# Altium project Cube Brain.PrjPcb
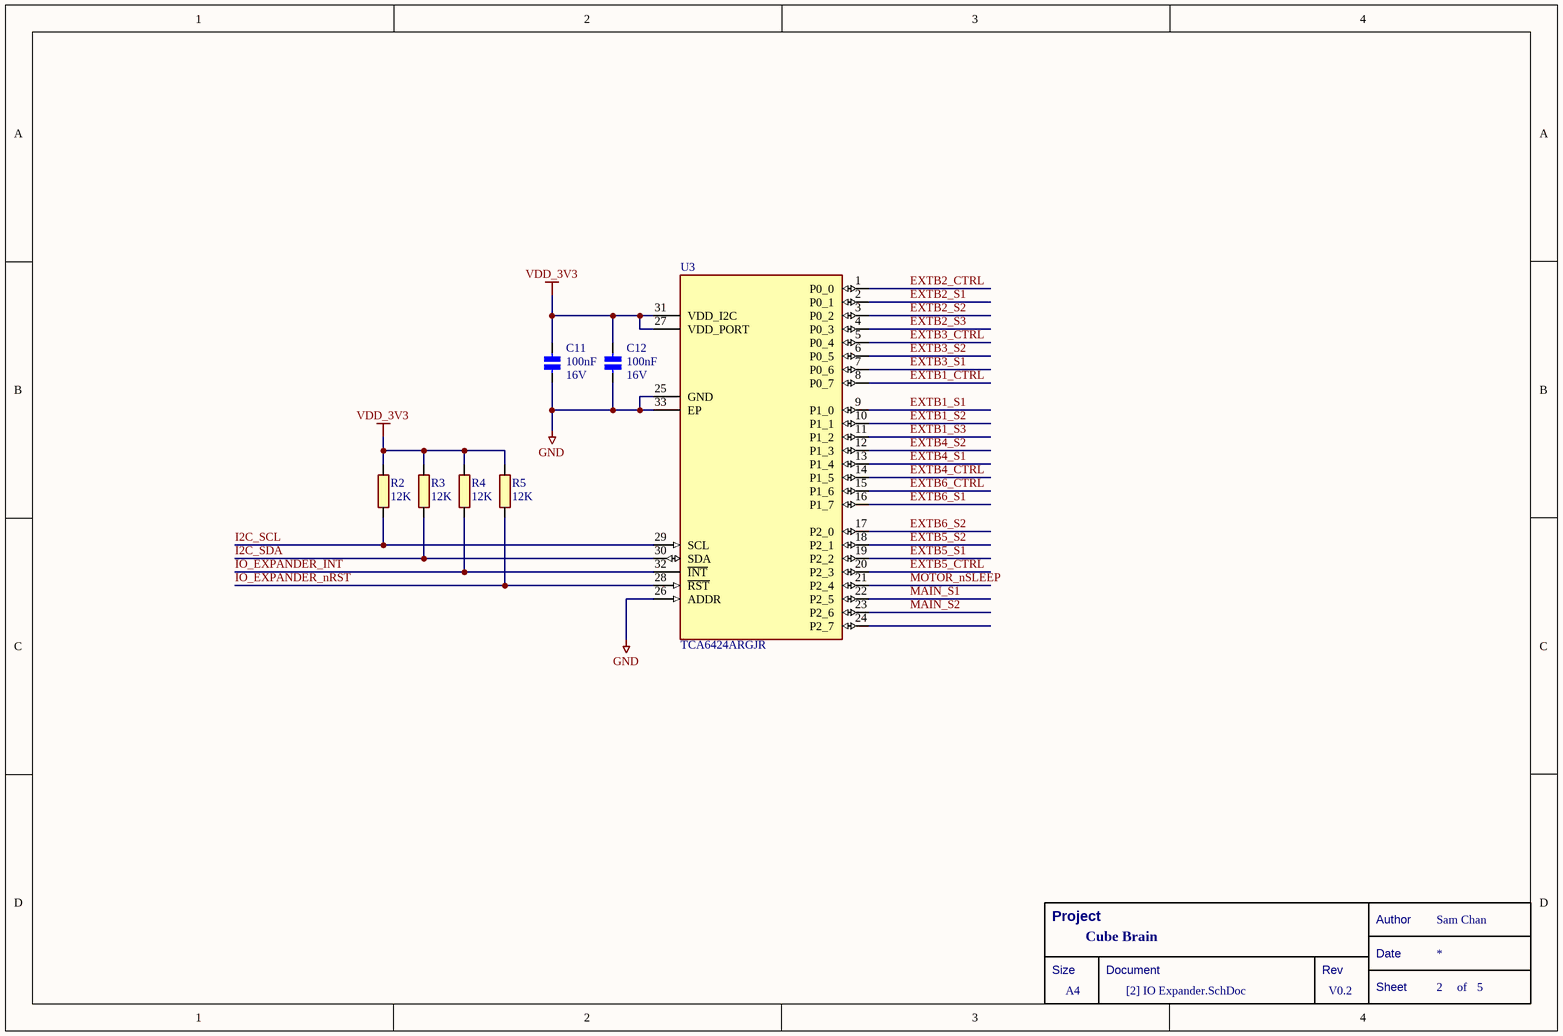
[diagram p0: [2] IO Expander.SchDoc]
Project: Cube Brain; VersionRevision: V0.2
3 sheets, 65 parts. Net scope: global (net labels, ports and power ports of the same name join across sheets).
Board file: Cube Brain.PcbDoc
Sheets:
  [2] IO Expander.SchDoc
  [5] Motors.SchDoc
  [4] Reflective Sensors.SchDoc

## Sheet [2] IO Expander.SchDoc
size A4; DocumentNumber: 2; SheetNumber: 2; SheetTotal: 5

### Parts
(Parts that share a designator on the sheet are numbered #1, #2 ... from top to bottom, then left to right.)
*#1  Title Block  (value not drawn)  (graphical)
C11  Voltage - Rated: 16V  [CAPC0402X05N]  (hidden comment: 100nF)
C12  Voltage - Rated: 16V  [CAPC0402X05N]  (hidden comment: 100nF)
R2  12K  [RESC0402X04N]
R3  12K  [RESC0402X04N]
R4  12K  [RESC0402X04N]
R5  12K  [RESC0402X04N]
U3  TCA6424ARGJR  [TCA6424ARGJR]

### Nets
GND: C11.2 C12.2 U3.25(GND) U3.26(ADDR) U3.33(EP)
VDD_3V3: C11.1 C12.1 R2.2 R3.2 R4.2 R5.2 U3.27(VDD_PORT) U3.31(VDD_I2C)
EXTB1_CTRL: U3.8(P0_7)
EXTB1_S1: U3.9(P1_0)
EXTB1_S2: U3.10(P1_1)
EXTB1_S3: U3.11(P1_2)
EXTB2_CTRL: U3.1(P0_0)
EXTB2_S1: U3.2(P0_1)
EXTB2_S2: U3.3(P0_2)
EXTB2_S3: U3.4(P0_3)
EXTB3_CTRL: U3.5(P0_4)
EXTB3_S1: U3.7(P0_6)
EXTB3_S2: U3.6(P0_5)
EXTB4_CTRL: U3.14(P1_5)
EXTB4_S1: U3.13(P1_4)
EXTB4_S2: U3.12(P1_3)
EXTB5_CTRL: U3.20(P2_3)
EXTB5_S1: U3.19(P2_2)
EXTB5_S2: U3.18(P2_1)
EXTB6_CTRL: U3.15(P1_6)
EXTB6_S1: U3.16(P1_7)
EXTB6_S2: U3.17(P2_0)
I2C_SCL: R2.1 U3.29(SCL)
I2C_SDA: R3.1 U3.30(SDA)
IO_EXPANDER_INT: R4.1 U3.32(~{INT})
IO_EXPANDER_nRST: R5.1 U3.28(~{RST})
MAIN_S1: U3.22(P2_5)
MAIN_S2: U3.23(P2_6)
MOTOR_nSLEEP: U3.21(P2_4)

Not connected (* = marked no-connect by the designer): U3 24(P2_7)

### Notes on the sheet
- (in symbol Title Block) Project; Author; Sam Chan; Date; Size; Document; Rev; A4; Sheet; of

### Library data of the parts
*#1 = Title Block: Standard Title Block
C11 C12 = CER 100NF 16V: CAP CER 0.1UF 16V X7R 0402; Manufacturer: Samsung Electro-Mechanics; Manufacturer Part Number: CL05B104KO5NNNC; Category: Capacitors; Supplier 1: LCSC; Supplier Part Number 1: C1525; Package / Case: 0402; Capacitance: 100nF
R2-R5 = RES 12K: RES SMD 12K OHM 1% 1/16W 0402; Manufacturer: YAGEO; Manufacturer Part Number: RC0402FR-0712KL; Category: Resistors; Package / Case: 0402; Supplier 1: LCSC; Supplier Part Number 1: C114760; Resistance: 12K
U3 = TCA6424ARGJR: IC I/O EXPANDER I2C 24B 32UQFN; Manufacturer: Texas Instruments; Categories: I/O Expanders; Case: 32-UFQFN Exposed Pad; Manufacturer Part Number: TCA6424ARGJR; Supplier 1: LCSC; Supplier Part Number 1: C80692

## Sheet [5] Motors.SchDoc
size A4; DocumentNumber: 5; SheetNumber: 5; SheetTotal: 5
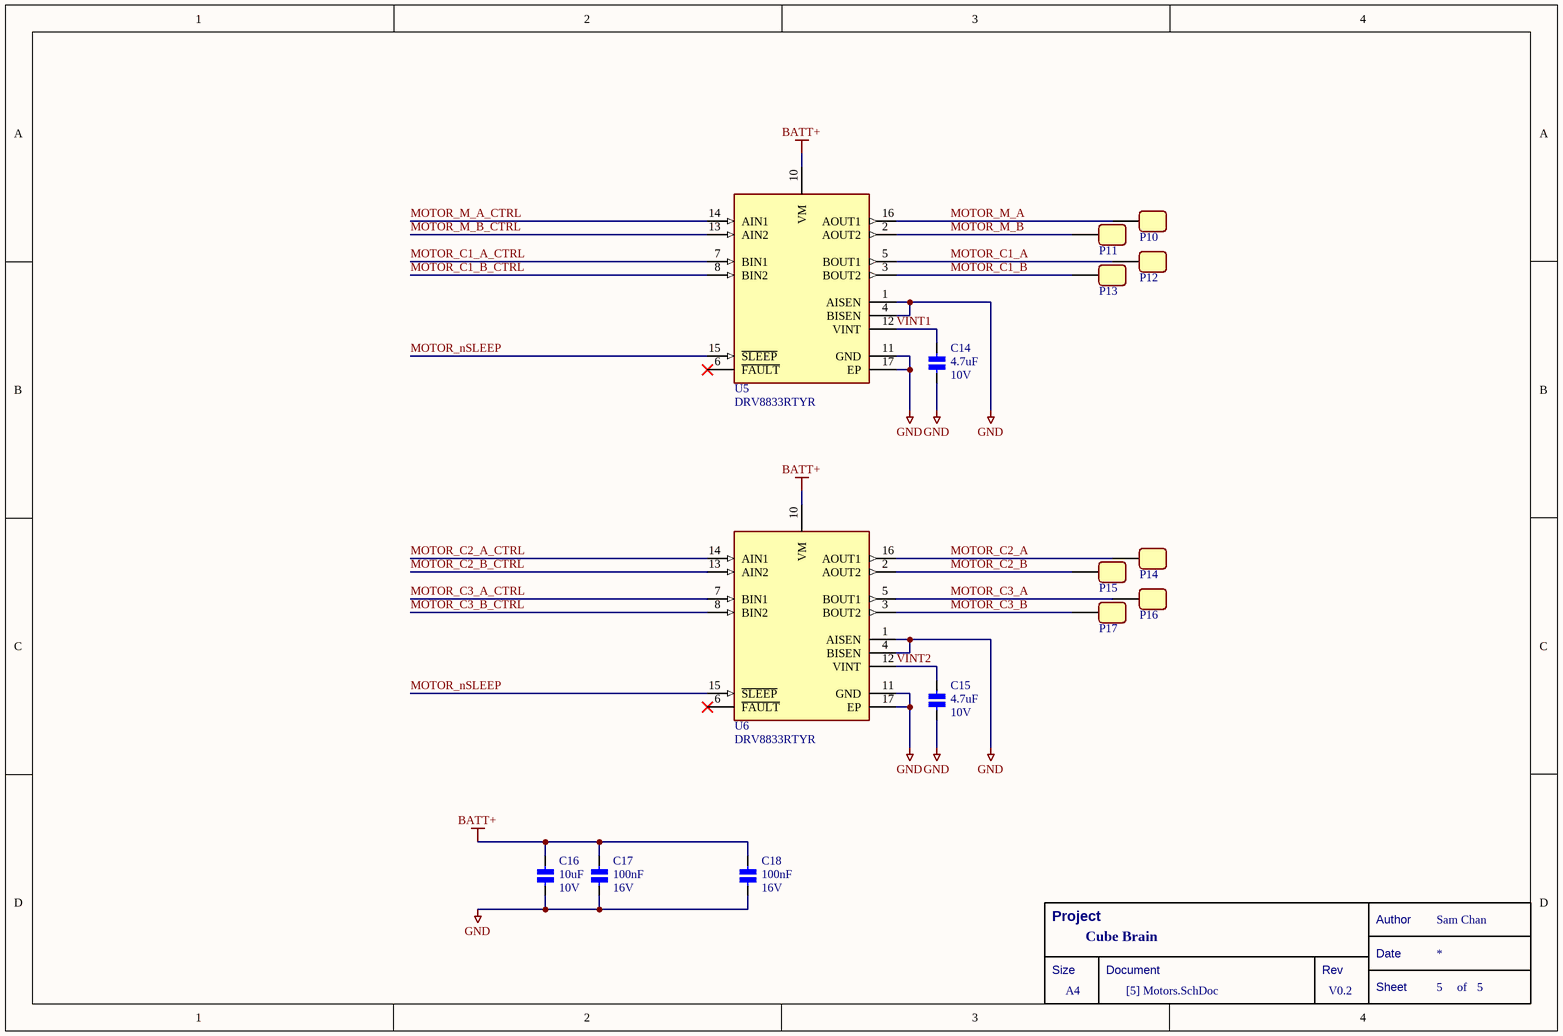
[diagram p1: [5] Motors.SchDoc]

### Parts
(Parts that share a designator on the sheet are numbered #1, #2 ... from top to bottom, then left to right.)
*#2  Title Block  (value not drawn)  (graphical)
C14  Voltage - Rated: 10V  [CAPC0402X05N]  (hidden comment: 4.7uF)
C15  Voltage - Rated: 10V  [CAPC0402X05N]  (hidden comment: 4.7uF)
C16  Voltage - Rated: 10V  [CAPC0402X05N]  (hidden comment: 10uF)
C17  Voltage - Rated: 16V  [CAPC0402X05N]  (hidden comment: 100nF)
C18  Voltage - Rated: 16V  [CAPC0402X05N]  (hidden comment: 100nF)
P10  PAD_4  [PAD_B2B]  (value not drawn)  (no BOM)
P11  PAD_4  [PAD_B2B]  (value not drawn)  (no BOM)
P12  PAD_4  [PAD_B2B]  (value not drawn)  (no BOM)
P13  PAD_4  [PAD_B2B]  (value not drawn)  (no BOM)
P14  PAD_4  [PAD_B2B]  (value not drawn)  (no BOM)
P15  PAD_4  [PAD_B2B]  (value not drawn)  (no BOM)
P16  PAD_4  [PAD_B2B]  (value not drawn)  (no BOM)
P17  PAD_4  [PAD_B2B]  (value not drawn)  (no BOM)
U5  DRV8833RTYR  [DRV8833CRTER]
U6  DRV8833RTYR  [DRV8833CRTER]

### Nets
BATT+: C16.1 C17.1 C18.1 U5.10(VM) U6.10(VM)
GND: C14.2 C15.2 C16.2 C17.2 C18.2 U5.1(AISEN) U5.4(BISEN) U5.11(GND) U5.17(EP) U6.1(AISEN) U6.4(BISEN) U6.11(GND) U6.17(EP)
MOTOR_C1_A: P12.1 U5.5(BOUT1)
MOTOR_C1_A_CTRL: U5.7(BIN1)
MOTOR_C1_B: P13.1 U5.3(BOUT2)
MOTOR_C1_B_CTRL: U5.8(BIN2)
MOTOR_C2_A: P14.1 U6.16(AOUT1)
MOTOR_C2_A_CTRL: U6.14(AIN1)
MOTOR_C2_B: P15.1 U6.2(AOUT2)
MOTOR_C2_B_CTRL: U6.13(AIN2)
MOTOR_C3_A: P16.1 U6.5(BOUT1)
MOTOR_C3_A_CTRL: U6.7(BIN1)
MOTOR_C3_B: P17.1 U6.3(BOUT2)
MOTOR_C3_B_CTRL: U6.8(BIN2)
MOTOR_M_A: P10.1 U5.16(AOUT1)
MOTOR_M_A_CTRL: U5.14(AIN1)
MOTOR_M_B: P11.1 U5.2(AOUT2)
MOTOR_M_B_CTRL: U5.13(AIN2)
MOTOR_nSLEEP: U5.15(~{SLEEP}) U6.15(~{SLEEP})
VINT1: C14.1 U5.12(VINT)
VINT2: C15.1 U6.12(VINT)

Not connected (* = marked no-connect by the designer): U5 6(~{FAULT})*; U6 6(~{FAULT})*

### Notes on the sheet
- (in symbol Title Block) Project; Author; Sam Chan; Date; Size; Document; Rev; A4; Sheet; of

### Library data of the parts
*#2 = Title Block: Standard Title Block
C14 C15 = CER 4.7UF 10V: CAP CER 4.7UF 10V X5R 0402; Manufacturer: Samsung Electro-Mechanics; Manufacturer Part Number: CL05A475MP5NRNC; Category: Capacitors; Supplier 1: LCSC; Supplier Part Number 1: C23733; Package / Case: 0402; Capacitance: 4.7uF
C16 = CER 10UF 10V: CAP CER 10UF 10V X5R 0402; Manufacturer: Murata Electronics; Manufacturer Part Number: GRM155R61A106ME44D; Category: Capacitors; Supplier 1: LCSC; Supplier Part Number 1: C77000; Package / Case: 0402; Capacitance: 10uF
C17 C18 = CER 100NF 16V: as C11 on sheet [2] IO Expander; Category: Capacitors; Supplier 1: LCSC; Supplier Part Number 1: C1525; Package / Case: 0402; Capacitance: 100nF
P10-P17 = PAD_4: a Pad for board to board connection
U5 U6 = DRV8833RTYR: IC MOTOR DRIVER; Manufacturer: Texas Instruments; Categories: Motor Drivers, Controllers; Case: 16-WQFN Exposed Pad; Manufacturer Part Number: DRV8833RTYR; Supplier 1: LCSC; Supplier Part Number 1: C154936

## Sheet [4] Reflective Sensors.SchDoc
size A4; DocumentNumber: 4; SheetNumber: 4; SheetTotal: 5
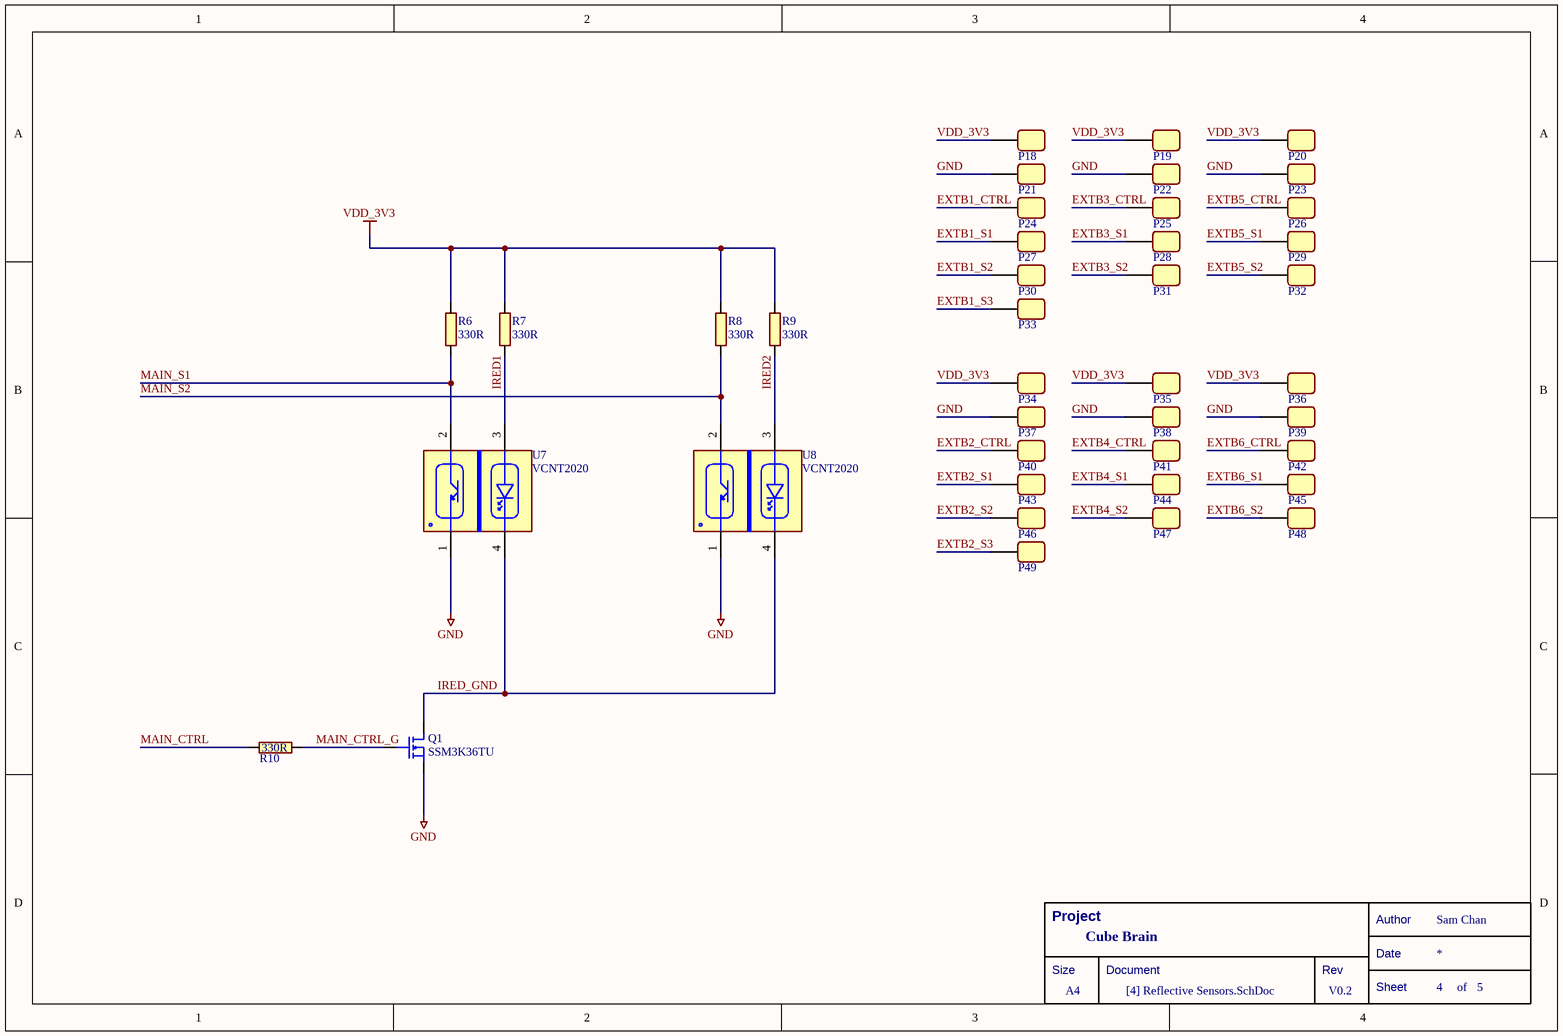
[diagram p2: [4] Reflective Sensors.SchDoc]

### Parts
(Parts that share a designator on the sheet are numbered #1, #2 ... from top to bottom, then left to right.)
*#3  Title Block  (value not drawn)  (graphical)
P18  PAD_4  [PAD_B2B]  (value not drawn)  (no BOM)
P19  PAD_4  [PAD_B2B]  (value not drawn)  (no BOM)
P20  PAD_4  [PAD_B2B]  (value not drawn)  (no BOM)
P21  PAD_4  [PAD_B2B]  (value not drawn)  (no BOM)
P22  PAD_4  [PAD_B2B]  (value not drawn)  (no BOM)
P23  PAD_4  [PAD_B2B]  (value not drawn)  (no BOM)
P24  PAD_4  [PAD_B2B]  (value not drawn)  (no BOM)
P25  PAD_4  [PAD_B2B]  (value not drawn)  (no BOM)
P26  PAD_4  [PAD_B2B]  (value not drawn)  (no BOM)
P27  PAD_4  [PAD_B2B]  (value not drawn)  (no BOM)
P28  PAD_4  [PAD_B2B]  (value not drawn)  (no BOM)
P29  PAD_4  [PAD_B2B]  (value not drawn)  (no BOM)
P30  PAD_4  [PAD_B2B]  (value not drawn)  (no BOM)
P31  PAD_4  [PAD_B2B]  (value not drawn)  (no BOM)
P32  PAD_4  [PAD_B2B]  (value not drawn)  (no BOM)
P33  PAD_4  [PAD_B2B]  (value not drawn)  (no BOM)
P34  PAD_4  [PAD_B2B]  (value not drawn)  (no BOM)
P35  PAD_4  [PAD_B2B]  (value not drawn)  (no BOM)
P36  PAD_4  [PAD_B2B]  (value not drawn)  (no BOM)
P37  PAD_4  [PAD_B2B]  (value not drawn)  (no BOM)
P38  PAD_4  [PAD_B2B]  (value not drawn)  (no BOM)
P39  PAD_4  [PAD_B2B]  (value not drawn)  (no BOM)
P40  PAD_4  [PAD_B2B]  (value not drawn)  (no BOM)
P41  PAD_4  [PAD_B2B]  (value not drawn)  (no BOM)
P42  PAD_4  [PAD_B2B]  (value not drawn)  (no BOM)
P43  PAD_4  [PAD_B2B]  (value not drawn)  (no BOM)
P44  PAD_4  [PAD_B2B]  (value not drawn)  (no BOM)
P45  PAD_4  [PAD_B2B]  (value not drawn)  (no BOM)
P46  PAD_4  [PAD_B2B]  (value not drawn)  (no BOM)
P47  PAD_4  [PAD_B2B]  (value not drawn)  (no BOM)
P48  PAD_4  [PAD_B2B]  (value not drawn)  (no BOM)
P49  PAD_4  [PAD_B2B]  (value not drawn)  (no BOM)
Q1  SSM3K36TU  [SSM3K36TU]
R6  330R  [RESC0402X04N]
R7  330R  [RESC0402X04N]
R8  330R  [RESC0402X04N]
R9  330R  [RESC0402X04N]
R10  330R  [RESC0402X04N]
U7  VCNT2020  [VCNT2020]
U8  VCNT2020  [VCNT2020]

### Nets
GND: P21.1 P22.1 P23.1 P37.1 P38.1 P39.1 Q1.2 U7.1 U8.1
VDD_3V3: P18.1 P19.1 P20.1 P34.1 P35.1 P36.1 R6.2 R7.2 R8.2 R9.2
EXTB1_CTRL: P24.1
EXTB1_S1: P27.1
EXTB1_S2: P30.1
EXTB1_S3: P33.1
EXTB2_CTRL: P40.1
EXTB2_S1: P43.1
EXTB2_S2: P46.1
EXTB2_S3: P49.1
EXTB3_CTRL: P25.1
EXTB3_S1: P28.1
EXTB3_S2: P31.1
EXTB4_CTRL: P41.1
EXTB4_S1: P44.1
EXTB4_S2: P47.1
EXTB5_CTRL: P26.1
EXTB5_S1: P29.1
EXTB5_S2: P32.1
EXTB6_CTRL: P42.1
EXTB6_S1: P45.1
EXTB6_S2: P48.1
IRED1: R7.1 U7.3
IRED2: R9.1 U8.3
IRED_GND: Q1.3 U7.4 U8.4
MAIN_CTRL: R10.2
MAIN_CTRL_G: Q1.1 R10.1
MAIN_S1: R6.1 U7.2
MAIN_S2: R8.1 U8.2

### Notes on the sheet
- (in symbol Title Block) Project; Author; Sam Chan; Date; Size; Document; Rev; A4; Sheet; of

### Library data of the parts
*#3 = Title Block: Standard Title Block
P18-P49 = PAD_4: a Pad for board to board connection
Q1 = SSM3K36TU: N-Channel 20V 500mA (Ta) 800mW (Ta) Surface Mount UFM; Manufacturer: Toshiba Semiconductor and Storage; Categories: Transistors; Case: UFM; Manufacturer Part Number: SSM3K36TU; Supplier 1: SSM3K36TULFCT-ND; Supplier Part Number 1: Digi-Key
R6-R10 = RES 330R: RES SMD 330R OHM 1% 1/16W 0402; Manufacturer: YAGEO; Manufacturer Part Number: RC0402FR-07330RL; Category: Resistors; Package / Case: 0402; Supplier 1: LCSC; Supplier Part Number 1: C105875; Resistance: 330R
U7 U8 = VCNT2020: REFLECTIVE SENSOR WITH PTR OUTPU; Manufacturer: Vishay Semiconductor Opto Division; Category: Optical Sensors; Case: 4-SMD Module; Manufacturer Part Number: VCNT2020; Supplier 1: RS; Supplier Part Number 1: 161-2156

## Nets that join several sheets
GND: [2] IO Expander (5 pins), [5] Motors (13 pins), [4] Reflective Sensors (9 pins)
VDD_3V3: [2] IO Expander (8 pins), [4] Reflective Sensors (10 pins)
EXTB1_CTRL: [2] IO Expander (U3.8), [4] Reflective Sensors (P24.1)
EXTB1_S1: [2] IO Expander (U3.9), [4] Reflective Sensors (P27.1)
EXTB1_S2: [2] IO Expander (U3.10), [4] Reflective Sensors (P30.1)
EXTB1_S3: [2] IO Expander (U3.11), [4] Reflective Sensors (P33.1)
EXTB2_CTRL: [2] IO Expander (U3.1), [4] Reflective Sensors (P40.1)
EXTB2_S1: [2] IO Expander (U3.2), [4] Reflective Sensors (P43.1)
EXTB2_S2: [2] IO Expander (U3.3), [4] Reflective Sensors (P46.1)
EXTB2_S3: [2] IO Expander (U3.4), [4] Reflective Sensors (P49.1)
EXTB3_CTRL: [2] IO Expander (U3.5), [4] Reflective Sensors (P25.1)
EXTB3_S1: [2] IO Expander (U3.7), [4] Reflective Sensors (P28.1)
EXTB3_S2: [2] IO Expander (U3.6), [4] Reflective Sensors (P31.1)
EXTB4_CTRL: [2] IO Expander (U3.14), [4] Reflective Sensors (P41.1)
EXTB4_S1: [2] IO Expander (U3.13), [4] Reflective Sensors (P44.1)
EXTB4_S2: [2] IO Expander (U3.12), [4] Reflective Sensors (P47.1)
EXTB5_CTRL: [2] IO Expander (U3.20), [4] Reflective Sensors (P26.1)
EXTB5_S1: [2] IO Expander (U3.19), [4] Reflective Sensors (P29.1)
EXTB5_S2: [2] IO Expander (U3.18), [4] Reflective Sensors (P32.1)
EXTB6_CTRL: [2] IO Expander (U3.15), [4] Reflective Sensors (P42.1)
EXTB6_S1: [2] IO Expander (U3.16), [4] Reflective Sensors (P45.1)
EXTB6_S2: [2] IO Expander (U3.17), [4] Reflective Sensors (P48.1)
MAIN_S1: [2] IO Expander (U3.22), [4] Reflective Sensors (R6.1 U7.2)
MAIN_S2: [2] IO Expander (U3.23), [4] Reflective Sensors (R8.1 U8.2)
MOTOR_nSLEEP: [2] IO Expander (U3.21), [5] Motors (U5.15 U6.15)